# Altium schematic sheet PWR_MGMT.SchDoc
size C; SheetNumber: 7; SheetTotal: 12
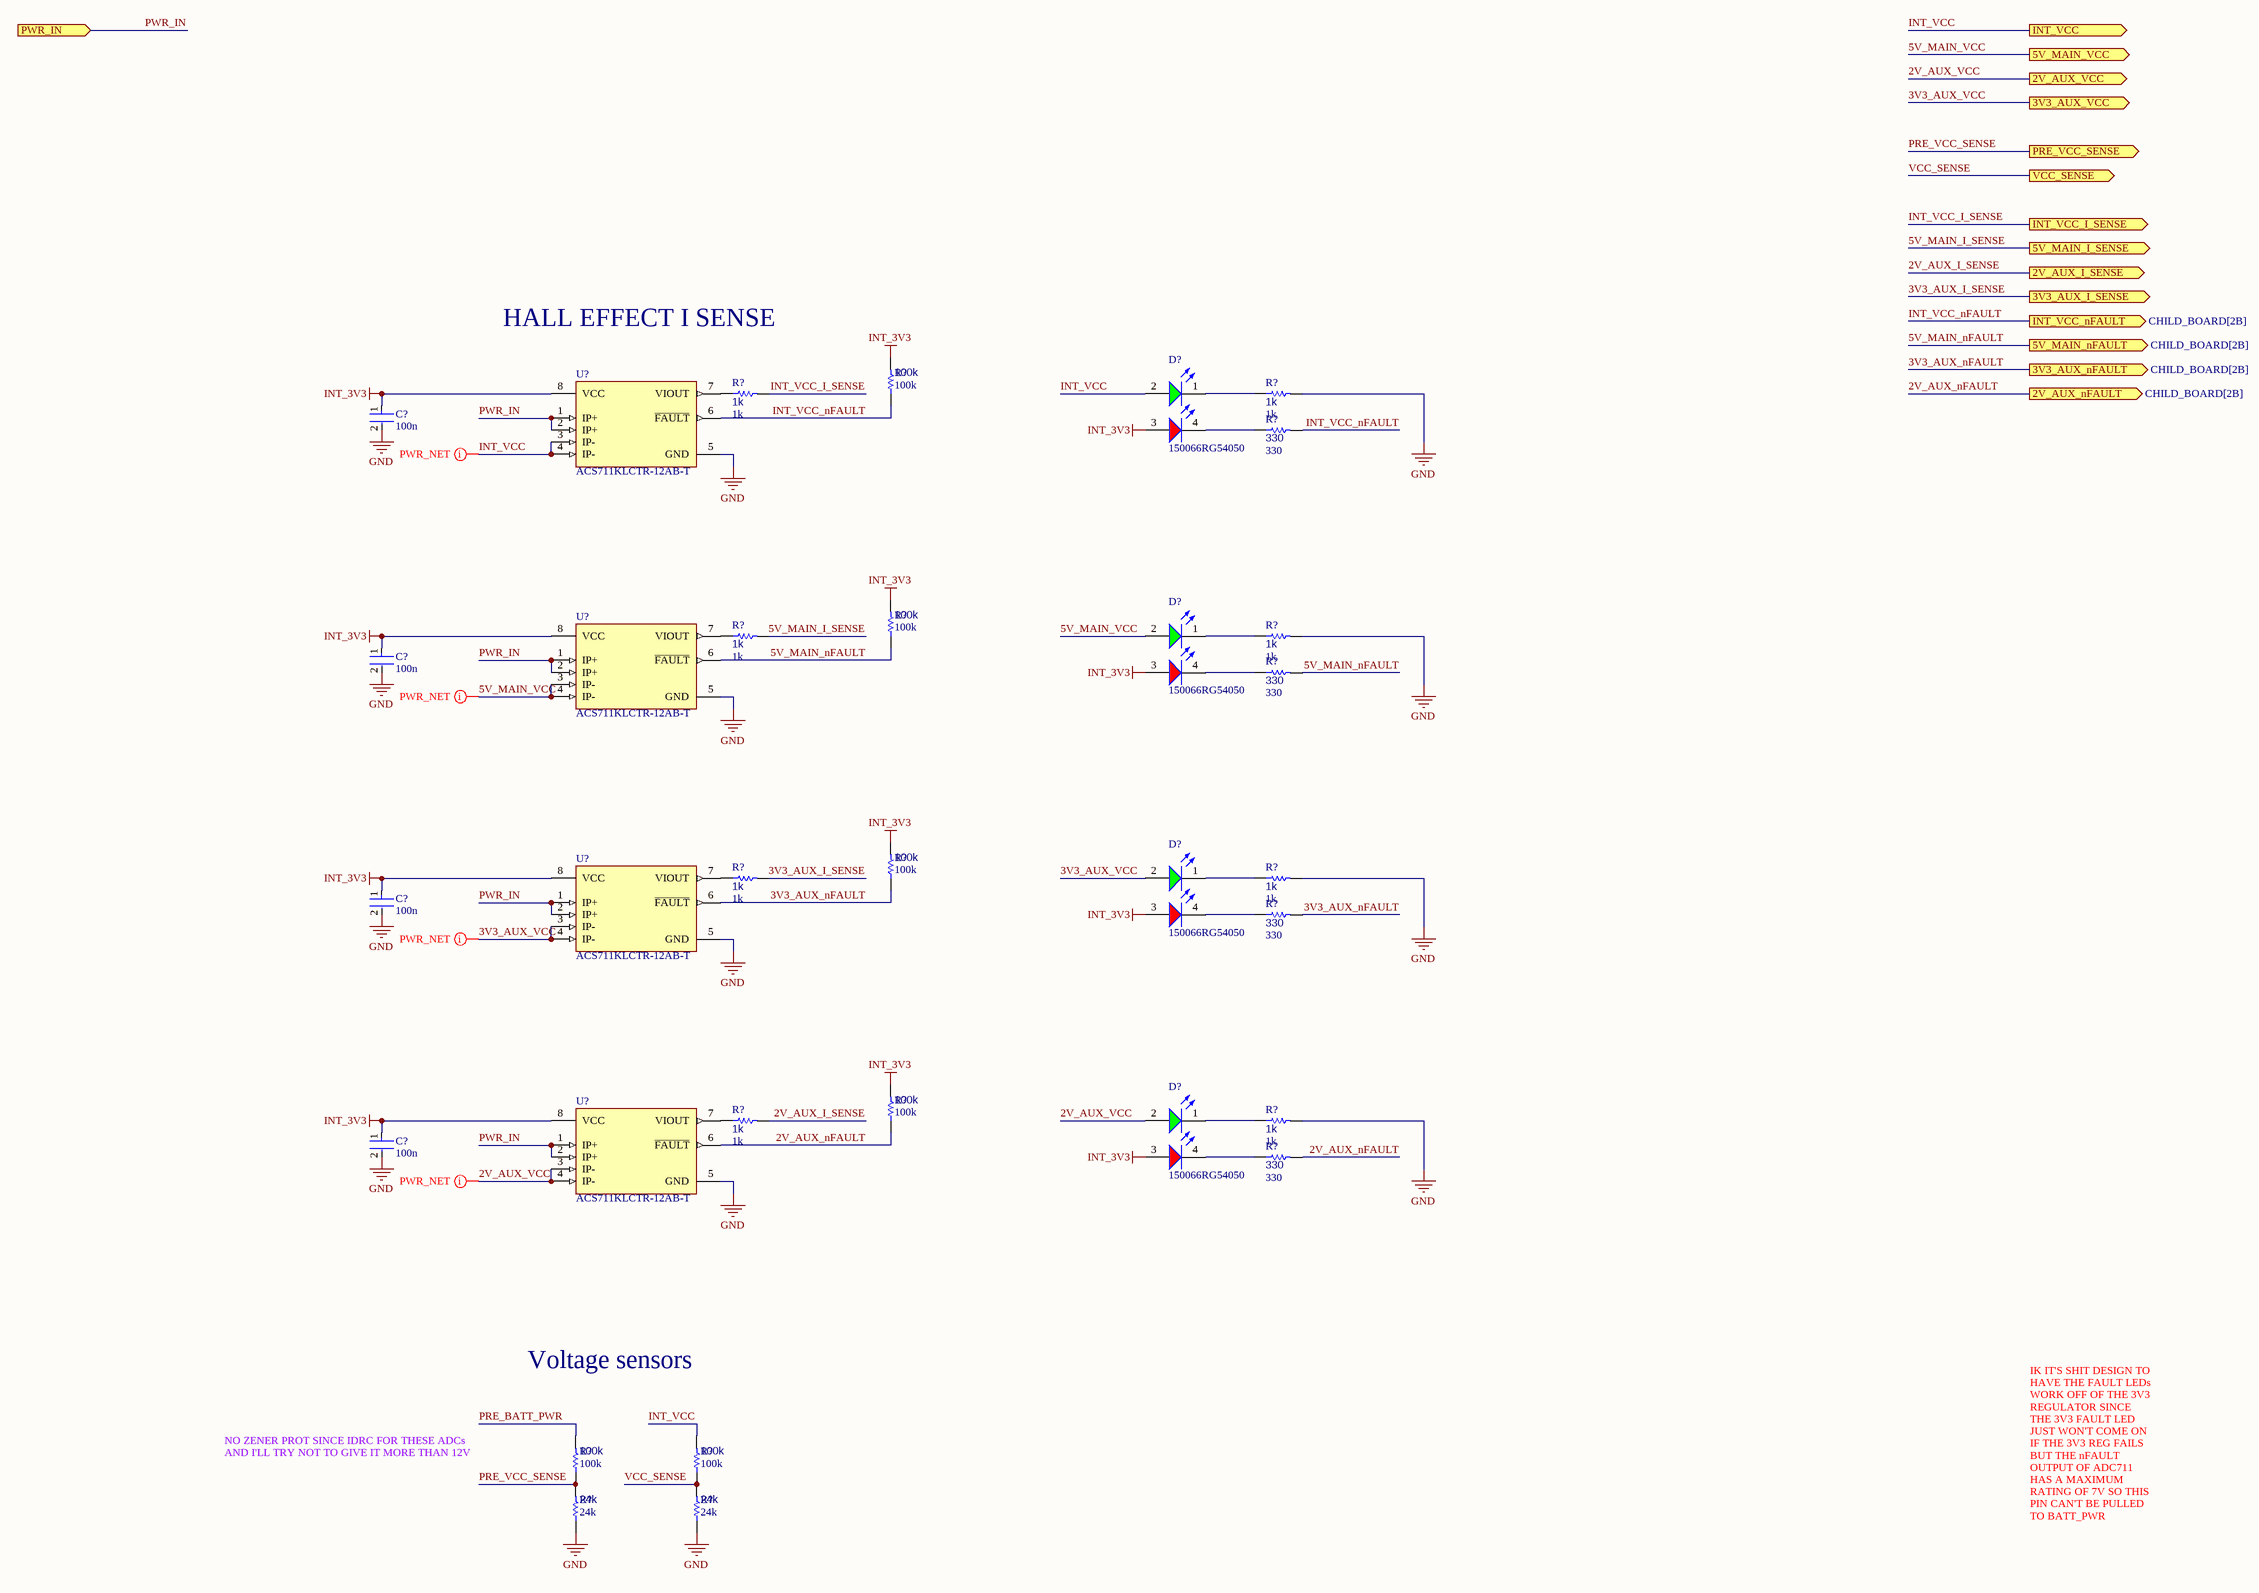
[diagram p0: PWR_MGMT.SchDoc]

## Parts
(Parts that share a designator on the sheet are numbered #1, #2 ... from top to bottom, then left to right.)
C?#1  100n  [FP-0402-L_1_0_0_05-W_0_5-IPC_A]
C?#2  100n  [FP-0402-L_1_0_0_05-W_0_5-IPC_A]
C?#3  100n  [FP-0402-L_1_0_0_05-W_0_5-IPC_A]
C?#4  100n  [FP-0402-L_1_0_0_05-W_0_5-IPC_A]
D?#1  150066RG54050  [WL-SBCD_0606]
D?#2  150066RG54050  [WL-SBCD_0606]
D?#3  150066RG54050  [WL-SBCD_0606]
D?#4  150066RG54050  [WL-SBCD_0606]
R?#1  100k  [R0603B]
R?#2  1k  [R0603B]
R?#3  1k  [R0603B]
R?#4  330  [R0603B]
R?#5  100k  [R0603B]
R?#6  1k  [R0603B]
R?#7  1k  [R0603B]
R?#8  330  [R0603B]
R?#9  100k  [R0603B]
R?#10  1k  [R0603B]
R?#11  1k  [R0603B]
R?#12  330  [R0603B]
R?#13  100k  [R0603B]
R?#14  1k  [R0603B]
R?#15  1k  [R0603B]
R?#16  330  [R0603B]
R?#17  100k  [R0603B]
R?#18  100k  [R0603B]
R?#19  24k  [R0603B]
R?#20  24k  [R0603B]
U?#1  ACS711KLCTR-12AB-T  [FP-LC-8-IPC_C]
U?#2  ACS711KLCTR-12AB-T  [FP-LC-8-IPC_C]
U?#3  ACS711KLCTR-12AB-T  [FP-LC-8-IPC_C]
U?#4  ACS711KLCTR-12AB-T  [FP-LC-8-IPC_C]

## Ports
2V_AUX_I_SENSE (out, see CHILD_BOARD[2B]), 2V_AUX_nFAULT (out, see CHILD_BOARD[2B]), 2V_AUX_VCC (out, see CHILD_BOARD[2B]), 3V3_AUX_I_SENSE (out, see CHILD_BOARD[2B]), 3V3_AUX_nFAULT (out, see CHILD_BOARD[2B]), 3V3_AUX_VCC (out, see CHILD_BOARD[2B]), 5V_MAIN_I_SENSE (out, see CHILD_BOARD[2B]), 5V_MAIN_nFAULT (out, see CHILD_BOARD[2B]), 5V_MAIN_VCC (out, see CHILD_BOARD[2A]), INT_VCC (out, see CHILD_BOARD[2A]), INT_VCC_I_SENSE (out, see CHILD_BOARD[2B]), INT_VCC_nFAULT (out, see CHILD_BOARD[2B]), PRE_VCC_SENSE (out, see CHILD_BOARD[2B]), PWR_IN (in, see CHILD_BOARD[2A], INT_REG[1A]), VCC_SENSE (out, see CHILD_BOARD[2B])

## Nets
GND: C?#1.2 C?#2.2 C?#3.2 C?#4.2 R?#3.2 R?#7.2 R?#11.2 R?#15.2 R?#19.1 R?#20.1 U?#1.5(GND) U?#2.5(GND) U?#3.5(GND) U?#4.5(GND)
INT_3V3: C?#1.1 C?#2.1 C?#3.1 C?#4.1 D?#1.3(A) D?#2.3(A) D?#3.3(A) D?#4.3(A) R?#1.2 R?#5.2 R?#9.2 R?#13.2 U?#1.8(VCC) U?#2.8(VCC) U?#3.8(VCC) U?#4.8(VCC)
2V_AUX_I_SENSE: R?#14.2 ; port 2V_AUX_I_SENSE
2V_AUX_nFAULT: R?#13.1 R?#16.2 U?#4.6(~{FAULT}) ; port 2V_AUX_nFAULT
2V_AUX_VCC: D?#4.2(A) U?#4.3(IP-) U?#4.4(IP-) ; port 2V_AUX_VCC
3V3_AUX_I_SENSE: R?#10.2 ; port 3V3_AUX_I_SENSE
3V3_AUX_nFAULT: R?#9.1 R?#12.2 U?#3.6(~{FAULT}) ; port 3V3_AUX_nFAULT
3V3_AUX_VCC: D?#3.2(A) U?#3.3(IP-) U?#3.4(IP-) ; port 3V3_AUX_VCC
5V_MAIN_I_SENSE: R?#6.2 ; port 5V_MAIN_I_SENSE
5V_MAIN_nFAULT: R?#5.1 R?#8.2 U?#2.6(~{FAULT}) ; port 5V_MAIN_nFAULT
5V_MAIN_VCC: D?#2.2(A) U?#2.3(IP-) U?#2.4(IP-) ; port 5V_MAIN_VCC
INT_VCC: D?#1.2(A) R?#18.2 U?#1.3(IP-) U?#1.4(IP-) ; port INT_VCC
INT_VCC_I_SENSE: R?#2.2 ; port INT_VCC_I_SENSE
INT_VCC_nFAULT: R?#1.1 R?#4.2 U?#1.6(~{FAULT}) ; port INT_VCC_nFAULT
PRE_BATT_PWR: R?#17.2
PRE_VCC_SENSE: R?#17.1 R?#19.2 ; port PRE_VCC_SENSE
PWR_IN: U?#1.1(IP+) U?#1.2(IP+) U?#2.1(IP+) U?#2.2(IP+) U?#3.1(IP+) U?#3.2(IP+) U?#4.1(IP+) U?#4.2(IP+) ; port PWR_IN
VCC_SENSE: R?#18.1 R?#20.2 ; port VCC_SENSE
NetD?#1_1: D?#1.1(K) R?#3.1
NetD?#1_4: D?#1.4(K) R?#4.1
NetD?#2_1: D?#2.1(K) R?#7.1
NetD?#2_4: D?#2.4(K) R?#8.1
NetD?#3_1: D?#3.1(K) R?#11.1
NetD?#3_4: D?#3.4(K) R?#12.1
NetD?#4_1: D?#4.1(K) R?#15.1
NetD?#4_4: D?#4.4(K) R?#16.1
NetR?#2_1: R?#2.1 U?#1.7(VIOUT)
NetR?#6_1: R?#6.1 U?#2.7(VIOUT)
NetR?#10_1: R?#10.1 U?#3.7(VIOUT)
NetR?#14_1: R?#14.1 U?#4.7(VIOUT)

## Layout directives
net class PWR: 2V_AUX_VCC, 3V3_AUX_VCC, 5V_MAIN_VCC, INT_VCC

## Notes on the sheet
- HALL EFFECT I SENSE
- Voltage sensors
- NO ZENER PROT SINCE IDRC FOR THESE ADCs
- AND I'LL TRY NOT TO GIVE IT MORE THAN 12V
- IK IT'S SHIT DESIGN TO HAVE THE FAULT LEDs WORK OFF OF THE 3V3 REGULATOR SINCE THE 3V3 FAULT LED JUST WON'T COME ON IF THE 3V3 REG FAILS BUT THE nFAULT OUTPUT OF ADC711 HAS A MAXIMUM RATING OF 7V SO THIS PIN CAN'T BE PULLED TO BATT_PWR

## Library data of the parts
C?#1-C?#4 = CMP-001-00058-1: LARGE PADS, 0402 CAP, CHANGE COMMENT TO MATCH REAL P/N; Capacitor Type: Ceramic; Min Operating Temperature: -55°C; Mounting Technology: Surface Mount; Pins: 2; Case/Package: 0402; RoHS Compliant: Yes; Max Operating Temperature: 85°C
D?#1-D?#4 = CMP-004-00040-2: Led, Red/Grn, 180Mcd/230Mcd, 624Nm/525Nm Rohs Compliant: Yes; Source: rgled.SchLib; Component Type: Standard; Design Item ID: CMP-004-00034-2; Pins: 4
R?#1-R?#20 = CMP-009-00002-14: Resistor
  R?#1 R?#5 R?#9 R?#13 R?#17 R?#18: Value: 100k
  R?#2 R?#3 R?#6 R?#7 R?#10 R?#11 R?#14 R?#15: Value: 1k
  R?#4 R?#8 R?#12 R?#16: Value: 330
  R?#19 R?#20: Value: 24k
U?#1-U?#4 = CMP-1557-00012-2: SENSOR CURRENT HALL 12.5A AC/DC; Number of Channels: 1; Min Supply Voltage: 3V; Sensitivity: 110mV/A; Response Time: 4.6us; Operating Supply Voltage: 3.3V; Max Supply Voltage: 5.5V; Max Supply Current: 5.5mA; Bandwidth: 100kHz; Linearity: 1%; Quiescent Current: 4mA; Accuracy: 5%; Polarity: Bidirectional; Case/Package: SOIC; Packaging: Tape and Reel; Number of Pins: 8; Width: 3.9mm; Frequency: 100kHz; -3db Bandwidth: 100kHz; REACH SVHC: No SVHC; Series: -; Height: 1.5mm; Package Quantity: 1; Min Operating Temperature: -40°C; Max Operating Temperature: 125°C; Current Sensing: 12.5A; RoHS Compliant: Yes; Length: 4.9mm